# EAGLE design M700A (EAGLE 6.6.0)
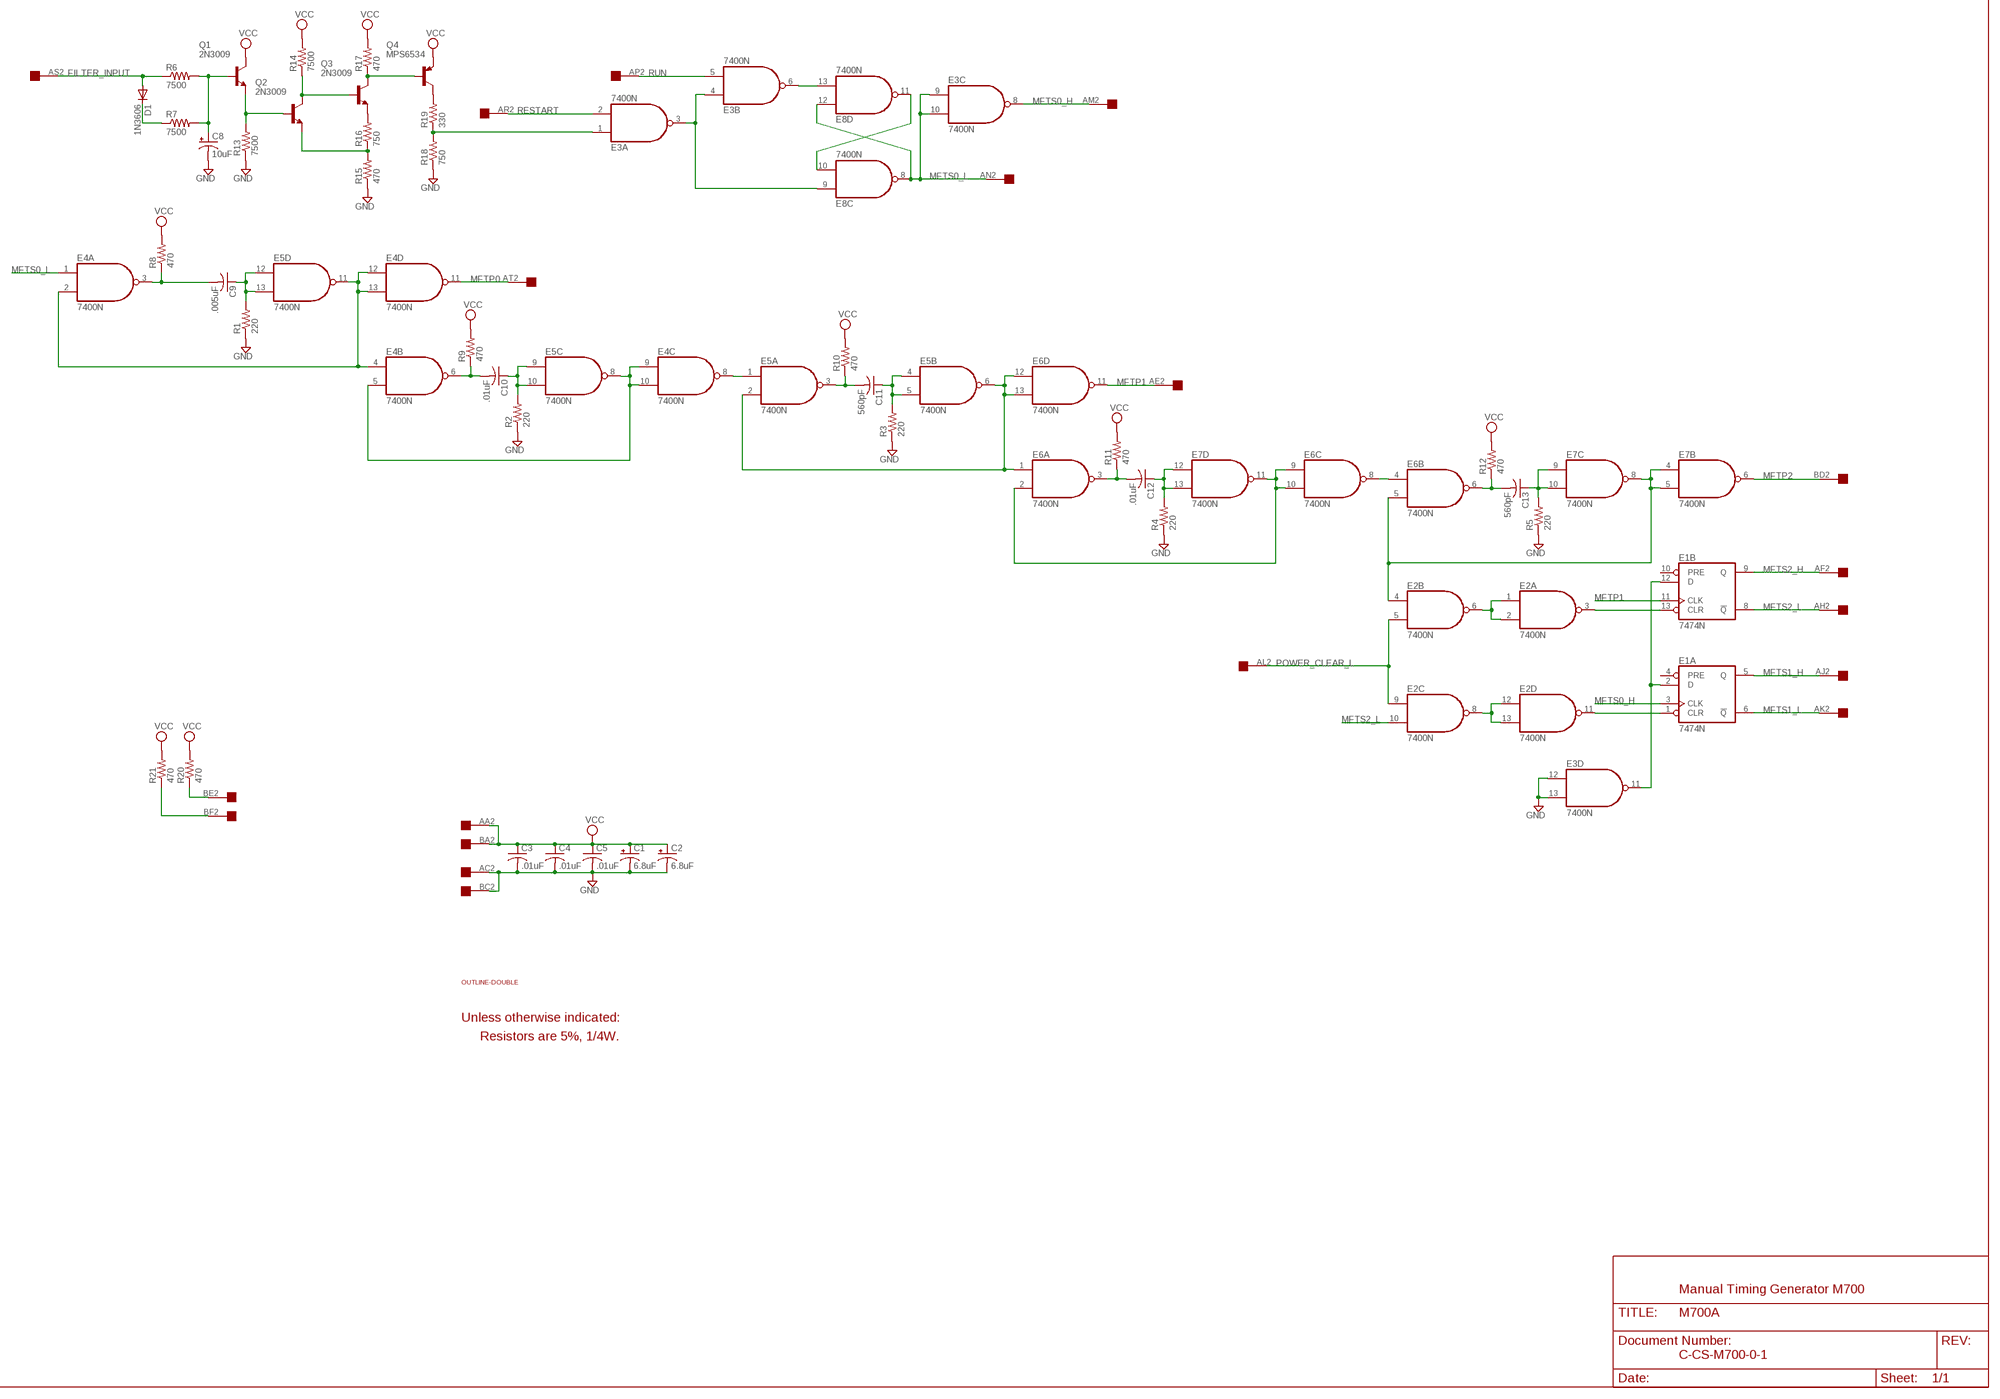
[diagram p0: schematic, sheet 1]

## Parts
C1  6.8uF  CPOL-USE15-5AXIAL  [E15-5]
C2  6.8uF  CPOL-USE15-5AXIAL  [E15-5]
C3  .01uF  C-US050-025X075  [C050-025X075]
C4  .01uF  C-US050-025X075  [C050-025X075]
C5  .01uF  C-US050-025X075  [C050-025X075]
C8  10uF  CPOL-USE15-5AXIAL  [E15-5]
C9  .005uF  C-US050-025X075  [C050-025X075]
C10  .01uF  C-US050-025X075  [C050-025X075]
C11  560pF  C-US050-025X075  [C050-025X075]
C12  .01uF  C-US050-025X075  [C050-025X075]
C13  560pF  C-US050-025X075  [C050-025X075]
D1  1N3606  1N4148DO35-10  [DO35-10]
E1  7474N  74S74N  [DIL14]
E2  7400N  [DIL14]
E3  7400N  [DIL14]
E4  7400N  [DIL14]
E5  7400N  [DIL14]
E6  7400N  [DIL14]
E7  7400N  [DIL14]
E8  7400N  [DIL14]
Q1  2N3009  2N2102  [TO5]
Q2  2N3009  2N2102  [TO5]
Q3  2N3009  2N2102  [TO5]
Q4  MPS6534  2N2905  [TO5]
R1  220  R-US_0207/10  [0207/10]
R2  220  R-US_0207/10  [0207/10]
R3  220  R-US_0207/10  [0207/10]
R4  220  R-US_0207/10  [0207/10]
R5  220  R-US_0207/10  [0207/10]
R6  7500  R-US_0207/10  [0207/10]
R7  7500  R-US_0207/10  [0207/10]
R8  470  R-US_0207/10  [0207/10]
R9  470  R-US_0207/10  [0207/10]
R10  470  R-US_0207/10  [0207/10]
R11  470  R-US_0207/10  [0207/10]
R12  470  R-US_0207/10  [0207/10]
R13  7500  R-US_0207/10  [0207/10]
R14  7500  R-US_0207/10  [0207/10]
R15  470  R-US_0207/10  [0207/10]
R16  750  R-US_0207/10  [0207/10]
R17  470  R-US_0207/10  [0207/10]
R18  750  R-US_0207/10  [0207/10]
R19  330  R-US_0207/10  [0207/10]
R20  470  R-US_0207/10  [0207/10]
R21  470  R-US_0207/10  [0207/10]
U$1  DOUBLE  [EDGE-CON4]
U$2  OUTLINE-DOUBLE  [DOUBLE]

## Nets
FILTER_INPUT: D1.A R6.1 U$1.AS2
GND [Supply]: C1.- C2.- C3.2 C4.2 C5.2 C8.- E3.12(D:I0) E3.13(D:I1) R1.1 R2.1 R3.1 R4.1 R5.1 R13.1 R15.1 R18.1 U$1.AC2 U$1.BC2
MFTP0: E4.11(D:O) U$1.AT2
MFTP1: E1.11(B:CLK) E6.11(D:O) U$1.AE2
MFTP2: E7.6(B:O) U$1.BD2
MFTS0_H: E1.3(A:CLK) E3.8(C:O) U$1.AM2
MFTS0_L: E3.9(C:I0) E3.10(C:I1) E4.1(A:I0) E8.8(C:O) E8.12(D:I0) U$1.AN2
MFTS1_H: E1.5(A:Q) U$1.AJ2
MFTS1_L: E1.6(A:!Q) U$1.AK2
MFTS2_H: E1.9(B:Q) U$1.AF2
MFTS2_L: E1.8(B:!Q) E2.10(C:I1) U$1.AH2
N$1: E1.13(B:CLR) E2.3(A:O)
N$2: E2.4(B:I0) E6.5(B:I1) E7.4(B:I0) E7.5(B:I1) E7.8(C:O)
N$3: C13.1 E7.9(C:I0) E7.10(C:I1) R5.2
N$4: C13.2 E6.6(B:O) R12.1
N$5: E2.1(A:I0) E2.2(A:I1) E2.6(B:O)
N$6: C8.+ Q1.2(B) R6.2 R7.2
N$7: E1.2(A:D) E1.12(B:D) E3.11(D:O)
N$8: D1.C R7.1
N$9: Q2.3(C) Q3.2(B) R14.1
N$10: Q1.1(E) Q2.2(B) R13.2
N$11: R21.1 U$1.BF2
N$12: R20.1 U$1.BE2
N$13: Q3.3(C) Q4.2(B) R17.1
N$14: Q3.1(E) R16.2
N$15: Q2.1(E) R15.2 R16.1
N$16: Q4.3(C) R19.2
N$17: E3.1(A:I0) R18.2 R19.1
N$18: E3.3(A:O) E3.4(B:I0) E8.9(C:I0)
N$19: E8.10(C:I1) E8.11(D:O)
N$20: C9.1 E5.12(D:I0) E5.13(D:I1) R1.2
N$21: E3.6(B:O) E8.13(D:I1)
N$22: C9.2 E4.3(A:O) R8.1
N$24: E4.2(A:I1) E4.4(B:I0) E4.12(D:I0) E4.13(D:I1) E5.11(D:O)
N$25: C10.2 E4.6(B:O) R9.1
N$26: C10.1 E5.9(C:I0) E5.10(C:I1) R2.2
N$27: E4.5(B:I1) E4.9(C:I0) E4.10(C:I1) E5.8(C:O)
N$28: C11.2 E5.3(A:O) R10.1
N$29: E4.8(C:O) E5.1(A:I0)
N$30: C11.1 E5.4(B:I0) E5.5(B:I1) R3.2
N$31: E5.2(A:I1) E5.6(B:O) E6.1(A:I0) E6.12(D:I0) E6.13(D:I1)
N$32: C12.2 E6.3(A:O) R11.1
N$33: C12.1 E7.12(D:I0) E7.13(D:I1) R4.2
N$34: E6.2(A:I1) E6.9(C:I0) E6.10(C:I1) E7.11(D:O)
N$35: E2.8(C:O) E2.12(D:I0) E2.13(D:I1)
N$36: E6.4(B:I0) E6.8(C:O)
N$38: E1.1(A:CLR) E2.11(D:O)
POWER_CLEAR_L: E2.5(B:I1) E2.9(C:I0) U$1.AL2
RESTART: E3.2(A:I1) U$1.AR2
RUN: E3.5(B:I1) U$1.AP2
VCC [Supply]: C1.+ C2.+ C3.1 C4.1 C5.1 Q1.3(C) Q4.1(E) R8.2 R9.2 R10.2 R11.2 R12.2 R14.2 R17.2 R20.2 R21.2 U$1.AA2 U$1.BA2
Unconnected: E1.4(A:PRE) E1.10(B:PRE) E7.1(A:I0) E7.2(A:I1) E7.3(A:O) E8.1(A:I0) E8.2(A:I1) E8.3(A:O) E8.4(B:I0) E8.5(B:I1) E8.6(B:O) U$1.AA1 U$1.AB1 U$1.AB2 U$1.AC1 U$1.AD1 U$1.AD2 U$1.AE1 U$1.AF1 U$1.AH1 U$1.AJ1 U$1.AK1 U$1.AL1 U$1.AM1 U$1.AN1 U$1.AP1 U$1.AR1 U$1.AS1 U$1.AT1 U$1.AU1 U$1.AU2 U$1.AV1 U$1.AV2 U$1.BA1 U$1.BB1 U$1.BB2 U$1.BC1 U$1.BD1 U$1.BE1 U$1.BF1 U$1.BH1 U$1.BH2 U$1.BJ1 U$1.BJ2 U$1.BK1 U$1.BK2 U$1.BL1 U$1.BL2 U$1.BM1 U$1.BM2 U$1.BN1 U$1.BN2 U$1.BP1 U$1.BP2 U$1.BR1 U$1.BR2 U$1.BS1 U$1.BS2 U$1.BT1 U$1.BT2 U$1.BU1 U$1.BU2 U$1.BV1 U$1.BV2

## Notes on the sheet
- Unless otherwise indicated:
- Resistors are 5%, 1/4W.
- Manual Timing Generator M700
- C-CS-M700-0-1

## Power pins joined to a net without a drawn wire
GND: E1.7(P:GND) E2.7(P:GND) E3.7(P:GND) E4.7(P:GND) E5.7(P:GND) E6.7(P:GND) E7.7(P:GND) E8.7(P:GND)
VCC: E1.14(P:VCC) E2.14(P:VCC) E3.14(P:VCC) E4.14(P:VCC) E5.14(P:VCC) E6.14(P:VCC) E7.14(P:VCC) E8.14(P:VCC)

## Library data of the parts
C1 C2 C8 = rcl:CPOL-US: POLARIZED CAPACITOR, American symbol
C3-C5 C9-C13 = rcl:C-US: CAPACITOR, American symbol
D1 = diode:1N4148: DIODE high speed (Philips)
E1 = 74xx-us:74*74: Dual D type positive edge triggered FLIP FLOP, preset and clear
E2-E8 = 74xx-us:74*00: Quad 2-input NAND gate
Q1-Q3 = transistor-npn:2N2102: NPN Transistor
Q4 = transistor-pnp:2N2905: PNP Transistor
R1-R21 = rcl:R-US_: RESISTOR, American symbol
U$1 = dec-con:DOUBLE: Double-Height DEC board
U$2 = dec-con:OUTLINE-*: Board outlines for DEC boards.

## Net classes
1 Supply: width 0.813 mm

## Board
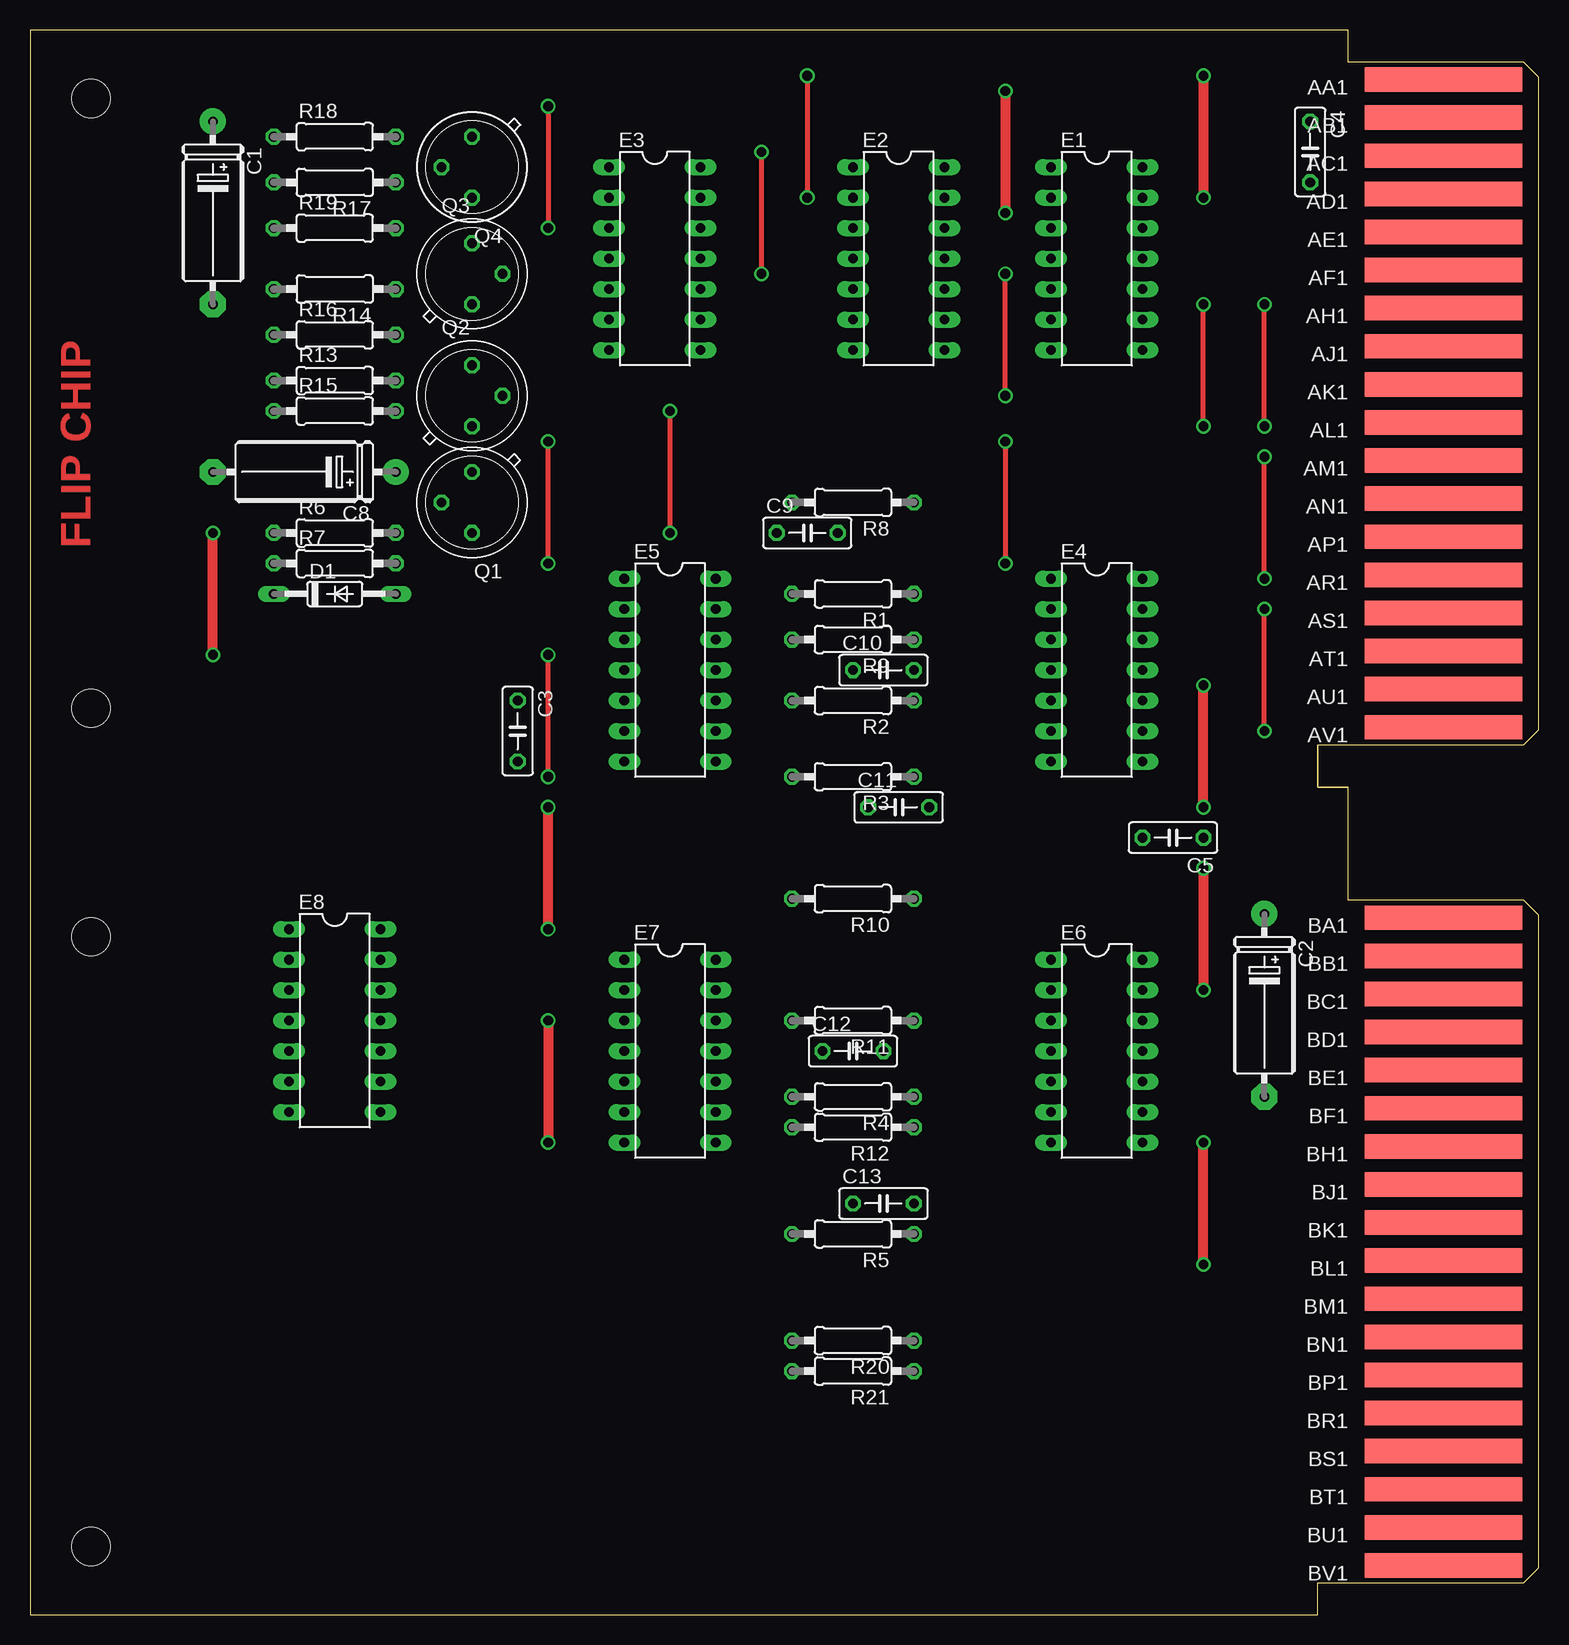
[diagram p1: board, top side]
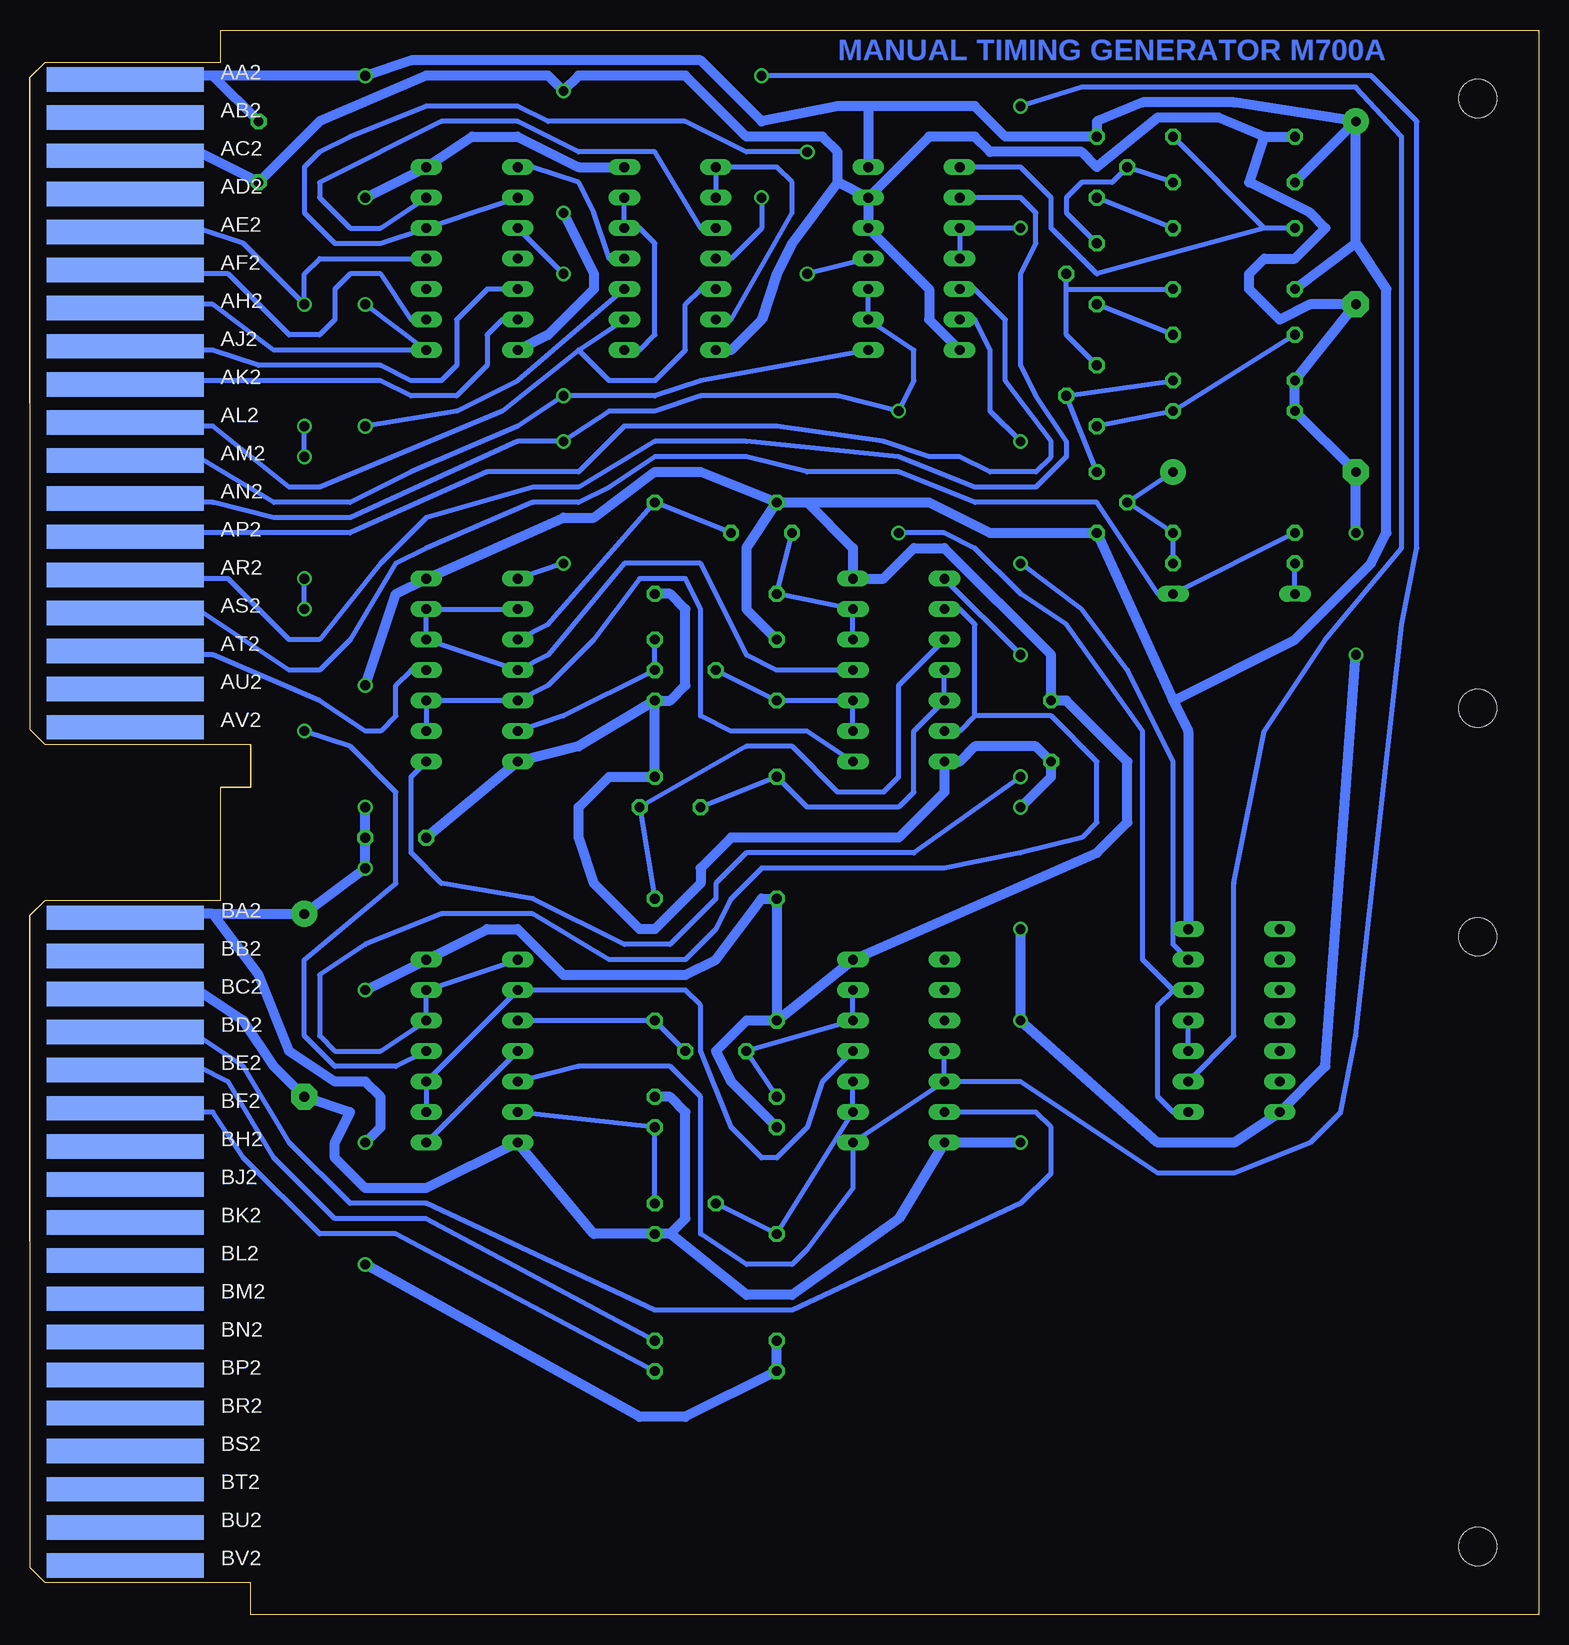
[diagram p2: board, bottom side, seen from below]

Size 125.73 x 132.08 mm. Coordinates in mm from the lower left corner, seen from the top.
Copper layers (1+16): Top 0.035mm / dielectric 1.5mm / Bottom 0.035mm
Design rules "16mils": minimum track width 16mil, minimum drill 32mil, track to track 15mil, track to pad 10mil, pad to pad 10mil, via to via 10mil, smd to smd 10mil, copper to edge 13mil, drill to drill 10mil, minimum pad ring 10mil, minimum via ring 8mil, stop-mask expansion 0mil, vias tented up to drill 0mil, thermal gap 10mil

### Footprints (pad centres in the part's own frame; a part is rotated, then mirrored left to right if it is on the bottom)
E15-5 = drill 0.813 pad 2.159: + -7.62,0 | drill 0.813 pad 2.159 octagon: - 7.62,0
C050-025X075 = drill 0.813 octagon: 1 -2.54,0; 2 2.54,0
DO35-10 = drill 0.813 long: A 5.08,0; C -5.08,0
DIL14 = drill 0.813 long: 1 -7.62,-3.81; 2 -5.08,-3.81; 3 -2.54,-3.81; 4 0,-3.81; 5 2.54,-3.81; 6 5.08,-3.81; 7 7.62,-3.81; 8 7.62,3.81; 9 5.08,3.81; 10 2.54,3.81; 11 0,3.81; 12 -2.54,3.81; 13 -5.08,3.81; 14 -7.62,3.81
TO5 = drill 0.813 octagon: 1 0,-2.54; 2 2.54,0; 3 0,2.54
0207/10 = drill 0.813 octagon: 1 -5.08,0; 2 5.08,0
EDGE-CON4 = smd 13.106 x 2.032: AA1 7.938,4.128; AB1 7.938,7.303; AC1 7.938,10.477; AD1 7.938,13.652; AE1 7.938,16.828; AF1 7.938,20.003; AH1 7.938,23.177; AJ1 7.938,26.352; AK1 7.938,29.527; AL1 7.938,32.703; AM1 7.938,35.877; AN1 7.938,39.053; AP1 7.938,42.227; AR1 7.938,45.403; AS1 7.938,48.578; AT1 7.938,51.752; AU1 7.938,54.928; AV1 7.938,58.102; BA1 7.938,73.978; BB1 7.938,77.153; BC1 7.938,80.328; BD1 7.938,83.502; BE1 7.938,86.677; BF1 7.938,89.853; BH1 7.938,93.028; BJ1 7.938,96.203; BK1 7.938,99.377; BL1 7.938,102.552; BM1 7.938,105.728; BN1 7.938,108.903; BP1 7.938,112.078; BR1 7.938,115.252; BS1 7.938,118.427; BT1 7.938,121.603; BU1 7.938,124.778; BV1 7.938,127.953 | smd 13.106 x 2.032 bottom: AA2 7.938,4.128; AB2 7.938,7.303; AC2 7.938,10.477; AD2 7.938,13.652; AE2 7.938,16.828; AF2 7.938,20.003; AH2 7.938,23.177; AJ2 7.938,26.352; AK2 7.938,29.527; AL2 7.938,32.703; AM2 7.938,35.877; AN2 7.938,39.053; AP2 7.938,42.227; AR2 7.938,45.403; AS2 7.938,48.578; AT2 7.938,51.752; AU2 7.938,54.928; AV2 7.938,58.102; BA2 7.938,73.978; BB2 7.938,77.153; BC2 7.938,80.328; BD2 7.938,83.502; BE2 7.938,86.677; BF2 7.938,89.853; BH2 7.938,93.028; BJ2 7.938,96.203; BK2 7.938,99.377; BL2 7.938,102.552; BM2 7.938,105.728; BN2 7.938,108.903; BP2 7.938,112.078; BR2 7.938,115.252; BS2 7.938,118.427; BT2 7.938,121.603; BU2 7.938,124.778; BV2 7.938,127.953
DOUBLE = hole 3.175: 120.65,56.515; 120.65,5.715; 120.65,75.565; 120.65,126.365

### Placement (x,y rotation side)
C1  15.24,116.84 270 top
C2  102.87,50.8 270 top
C3  40.64,73.66 270 top
C4  106.68,121.92 270 top
C5  95.25,64.77 180 top
C8  22.86,95.25 180 top
C9  64.77,90.17 0 top
C10  71.12,78.74 0 top
C11  72.39,67.31 0 top
C12  68.58,46.99 0 top
C13  71.12,34.29 0 top
D1  25.4,85.09 0 top
E1  88.9,113.03 270 top
E2  72.39,113.03 270 top
E3  52.07,113.03 270 top
E4  88.9,78.74 270 top
E5  53.34,78.74 270 top
E6  88.9,46.99 270 top
E7  53.34,46.99 270 top
E8  25.4,49.53 270 top
Q1  36.83,92.71 180 top
Q2  36.83,101.6 0 top
Q3  36.83,111.76 0 top
Q4  36.83,120.65 180 top
R1  68.58,85.09 180 top
R2  68.58,76.2 180 top
R3  68.58,69.85 180 top
R4  68.58,43.18 180 top
R5  68.58,31.75 180 top
R6  25.4,90.17 0 top
R7  25.4,87.63 0 top
R8  68.58,92.71 180 top
R9  68.58,81.28 180 top
R10  68.58,59.69 180 top
R11  68.58,49.53 180 top
R12  68.58,40.64 180 top
R13  25.4,102.87 0 top
R14  25.4,110.49 180 top
R15  25.4,100.33 0 top
R16  25.4,106.68 0 top
R17  25.4,119.38 180 top
R18  25.4,123.19 0 top
R19  25.4,115.57 0 top
R20  68.58,22.86 180 top
R21  68.58,20.32 180 top
U$1  125.73,132.08 180 top
U$2  125.73,132.08 180 top
U$4  [FLIPCHIP]  0,69.85 0 top

### Tracks (layer width: path | path; a pad name or v marks a point on that pad's centre or on a via)
FILTER_INPUT
  Bottom 0.406: R6.1 D1.A 31.75,85.09 36.83,92.71 46.99,92.71 53.34,95.25 60.96,95.25 66.04,96.52 73.66,96.52 77.47,93.98 80.01,92.71 83.82,92.71 92.71,88.9 95.25,87.63 99.06,81.28 101.6,78.74 104.14,78.74 111.76,83.82 116.84,83.82 U$1.AS2
GND  (via drill 0.81)
  Top 0.813: v15.24,80.01 v15.24,90.17 | v43.18,57.15 v43.18,67.31 | v43.18,49.53 v43.18,39.37 | v81.28,127 v81.28,116.84
  Bottom 0.813: v15.24,90.17 C8.- R15.1 R13.1 C1.- 19.05,109.22 21.59,107.95 24.13,110.49 24.13,111.76 22.86,113.03 20.32,113.03 17.78,115.57 19.05,116.84 24.13,119.38 22.86,123.19 | v15.24,80.01 17.78,45.72 E8.7 25.4,39.37 31.75,39.37 v43.18,49.53 v43.18,57.15 | v43.18,39.37 E7.7 53.34,33.02 62.23,26.67 66.04,26.67 72.39,31.75 | v43.18,67.31 40.64,69.85 C3.2 41.91,72.39 46.99,72.39 48.26,71.12 E5.7 49.53,68.58 53.34,64.77 67.31,64.77 69.85,62.23 69.85,60.96 73.66,57.15 74.93,57.15 78.74,60.96 80.01,64.77 80.01,67.31 77.47,69.85 R3.1 R2.1 | 22.86,123.19 R18.1 | E3.7 50.8,107.95 50.8,110.49 E3.12 E3.13 | E3.13 50.8,123.19 46.99,123.19 45.72,121.92 38.1,121.92 36.83,120.65 31.75,124.78 26.67,124.78 22.86,123.19 | U$1.AC2 116.84,121.92 111.76,121.92 C4.2 101.6,124.46 92.71,128.27 82.55,128.27 v81.28,127 80.01,128.27 71.12,128.27 66.04,123.19 59.69,123.19 58.42,121.92 58.42,119.38 | E3.13 58.42,119.38 | E2.7 67.31,105.41 64.77,107.95 63.5,111.76 62.23,114.3 58.42,119.38 | E1.7 82.55,106.68 78.74,110.49 78.74,111.76 v81.28,116.84 | U$1.BC2 116.84,52.07 111.76,52.07 107.95,49.53 105.41,45.72 C2.- 99.06,41.91 100.33,39.37 100.33,38.1 97.79,35.56 92.71,35.56 E6.7 78.74,31.75 R5.1 | R2.1 80.01,72.39 E4.7 C5.2 | 72.39,31.75 R5.1 | R1.1 72.39,85.09 71.12,83.82 71.12,77.47 72.39,76.2 R2.1 | R4.1 72.39,43.18 71.12,41.91 71.12,33.02 72.39,31.75 | 72.39,31.75 R5.1
MFTP0
  Bottom 0.406: U$1.AT2 116.84,80.01 110.49,80.01 101.6,76.2 97.79,73.66 96.52,73.66 95.25,74.93 95.25,77.47 93.98,78.74 E4.11
MFTP1  (via drill 0.81)
  Top 0.406: v102.87,99.06 v102.87,109.22 | v102.87,86.36 v102.87,96.52 | v102.87,73.66 v102.87,83.82
  Bottom 0.406: U$1.AE2 116.84,115.57 111.76,115.57 107.95,114.3 v102.87,109.22 102.87,111.76 101.6,113.03 E1.11 | v102.87,96.52 v102.87,99.06 | v102.87,83.82 v102.87,86.36 | v102.87,73.66 99.06,72.39 95.25,68.58 95.25,60.96 102.87,54.61 102.87,48.26 100.33,45.72 95.25,45.72 E6.11
MFTP2
  Bottom 0.406: U$1.BD2 116.84,48.26 111.76,48.26 107.95,45.72 104.14,39.37 99.06,34.29 92.71,34.29 73.66,25.4 62.23,25.4 43.18,34.29 40.64,36.83 40.64,40.64 41.91,41.91 E7.6
MFTS0_H  (via drill 0.81)
  Top 0.406: v81.28,101.6 v81.28,111.76
  Bottom 0.406: v81.28,111.76 E1.3 | U$1.AM2 116.84,96.52 111.76,96.52 105.41,92.71 99.06,92.71 93.98,95.25 85.09,99.06 v81.28,101.6 73.66,101.6 69.85,102.87 E3.8
MFTS0_L  (via drill 0.81)
  Top 0.406: v53.34,90.17 v53.34,100.33 | v81.28,97.79 v81.28,87.63
  Bottom 0.406: 30.48,52.07 E8.12 | 30.48,52.07 31.75,50.8 31.75,43.18 30.48,41.91 E8.8 | 30.48,52.07 33.02,54.61 33.02,73.66 39.37,82.55 43.18,85.09 46.99,88.9 49.53,90.17 v53.34,90.17 | E3.10 E3.9 52.07,105.41 52.07,102.87 v53.34,100.33 58.42,101.6 69.85,101.6 73.66,100.33 77.47,100.33 v81.28,97.79 85.09,97.79 99.06,91.44 105.41,91.44 110.49,92.71 116.84,92.71 U$1.AN2 | v81.28,87.63 E4.1
MFTS1_H
  Bottom 0.406: U$1.AJ2 115.57,105.41 110.49,105.41 106.68,104.14 96.52,104.14 93.98,102.87 91.44,102.87 90.17,104.14 90.17,107.95 87.63,110.49 E1.5
MFTS1_L
  Bottom 0.406: E1.6 86.36,107.95 87.63,106.68 87.63,104.14 90.17,101.6 93.98,101.6 96.52,102.87 116.84,102.87 U$1.AK2
MFTS2_H
  Bottom 0.406: U$1.AF2 116.84,111.76 109.22,111.76 104.14,106.68 101.6,106.68 100.33,107.95 100.33,110.49 99.06,111.76 96.52,111.76 93.98,107.95 E1.9
MFTS2_L  (via drill 0.81)
  Top 0.406: v97.79,99.06 v97.79,109.22
  Bottom 0.406: E2.10 85.09,102.87 90.17,100.33 v97.79,99.06 | v97.79,109.22 E1.8 105.41,105.41 110.49,109.22 116.84,109.22 U$1.AH2
N$1
  Bottom 0.406: E1.13 96.52,115.57 99.06,115.57 101.6,118.11 101.6,119.38 91.44,124.46 85.09,124.46 80.01,121.92 73.66,121.92 69.85,115.57 E2.3
N$2  (via drill 0.81)
  Top 0.406: v64.77,128.27 v64.77,118.11
  Bottom 0.406: E7.5 E7.4 | E7.5 E7.8 57.15,35.56 60.96,30.48 62.23,29.21 66.04,29.21 69.85,31.75 69.85,43.18 72.39,45.72 80.01,45.72 E6.5 | E7.5 43.18,44.45 31.75,36.83 25.4,36.83 19.05,39.37 16.51,41.91 15.24,48.26 11.43,82.55 10.16,88.9 10.16,124.46 13.97,128.27 v64.77,128.27 | v64.77,118.11 64.77,115.57 67.31,113.03 E2.4
N$3
  Bottom 0.406: C13.1 R5.2 E7.9 E7.10
N$4
  Bottom 0.406: E6.6 R12.1 C13.2
N$5
  Bottom 0.406: E2.2 E2.1 63.5,120.65 62.23,119.38 62.23,116.84 67.31,107.95 E2.6
N$6
  Bottom 0.406: R7.2 R6.2 Q1.2 C8.+
N$7  (via drill 0.81)
  Top 0.406: v60.96,111.76 v60.96,121.92
  Bottom 0.406: E3.11 v60.96,111.76 | v60.96,121.92 66.04,121.92 71.12,124.46 82.55,124.46 85.09,125.73 92.71,125.73 99.06,123.19 101.6,121.92 102.87,120.65 102.87,116.84 100.33,114.3 96.52,114.3 E1.12 88.9,116.84 E1.2
N$8
  Bottom 0.406: D1.C R7.1
N$9
  Bottom 0.406: 39.37,110.49 39.37,106.68 Q2.3 | 39.37,110.49 Q3.2 | 39.37,110.49 R14.1
N$10
  Bottom 0.406: Q1.1 Q2.2 R13.2
N$11
  Bottom 0.406: R21.1 95.25,31.75 101.6,31.75 107.95,38.1 110.49,41.91 116.84,41.91 U$1.BF2
N$12
  Bottom 0.406: R20.1 92.71,33.02 100.33,33.02 105.41,38.1 109.22,44.45 111.76,45.72 116.84,45.72 U$1.BE2
N$13
  Bottom 0.406: R17.1 Q4.2 35.56,119.38 38.1,119.38 39.37,118.11 39.37,116.84 Q3.3
N$14
  Bottom 0.406: R16.2 Q3.1
N$15
  Bottom 0.406: Q2.1 R15.2 R16.1
N$16
  Bottom 0.406: R19.2 Q4.3
N$17
  Bottom 0.406: E3.1 43.18,120.65 40.64,118.11 40.64,115.57 36.83,111.76 22.86,115.57 | R19.1 22.86,115.57 | 22.86,115.57 R18.2
N$18  (via drill 0.81)
  Top 0.406: v43.18,125.73 v43.18,115.57
  Bottom 0.406: E8.9 25.4,48.26 25.4,60.96 22.86,73.66 17.78,81.28 11.43,88.9 11.43,123.19 15.24,127.32 38.1,127.32 v43.18,125.73 | v43.18,115.57 E3.3 E3.4
N$19
  Bottom 0.406: E8.10 E8.11
N$20
  Bottom 0.406: E5.12 E5.13 R1.2 C9.1
N$21  (via drill 0.81)
  Top 0.406: v43.18,87.63 v43.18,97.79
  Bottom 0.406: E3.6 46.99,107.95 45.72,105.41 45.72,100.33 v43.18,97.79 | v43.18,87.63 38.1,83.82 34.29,78.74 30.48,71.12 30.48,55.88 E8.13
N$22
  Bottom 0.406: E4.3 82.55,82.55 R8.1 C9.2
N$24
  Bottom 0.406: E4.2 E4.13 E4.12 E4.4 82.55,80.01 76.2,87.63 69.85,87.63 66.04,80.01 63.5,78.74 E5.11
N$25
  Bottom 0.406: E4.6 81.28,74.93 C10.2 R9.1
N$26
  Bottom 0.406: E5.9 E5.10 R2.2 C10.1
N$27
  Bottom 0.406: E4.9 E4.10 E4.5 82.55,77.47 78.74,81.28 74.93,86.36 71.12,86.36 69.85,83.82 69.85,74.93 67.31,73.66 60.96,73.66 E5.8
N$28
  Bottom 0.406: R10.1 C11.2 66.04,72.39 62.23,72.39 58.42,68.58 54.61,68.58 53.34,69.85 53.34,77.47 E5.3
N$29  (via drill 0.81)
  Top 0.406: v43.18,69.85 v43.18,80.01
  Bottom 0.406: E4.8 93.98,69.85 93.98,63.5 91.44,60.96 83.82,59.69 76.2,55.88 72.39,55.88 68.58,59.69 68.58,60.96 66.04,63.5 52.07,63.5 v43.18,69.85 | v43.18,80.01 E5.1
N$30
  Bottom 0.406: C11.1 R3.2 60.96,67.31 53.34,67.31 52.07,68.58 52.07,73.66 E5.5 E5.4
N$31
  Bottom 0.406: E5.6 48.26,73.66 46.99,74.93 | 46.99,74.93 46.99,82.55 48.26,83.82 E5.2 | E6.1 E6.13 E6.12 96.52,46.99 100.33,46.99 101.6,48.26 101.6,53.34 97.79,55.88 91.44,58.42 83.82,58.42 77.47,54.61 71.12,54.61 68.58,57.15 67.31,59.69 64.77,62.23 49.53,62.23 43.18,63.5 38.1,64.77 36.83,66.04 36.83,71.12 40.64,74.93 46.99,74.93
N$32
  Bottom 0.406: C12.2 R11.1 E6.3
N$33
  Bottom 0.406: E7.13 E7.12 C12.1 R4.2
N$34
  Bottom 0.406: E6.9 E6.10 E6.2 71.12,52.07 69.85,50.8 69.85,46.99 67.31,40.64 64.77,38.1 63.5,38.1 60.96,40.64 59.69,44.45 E7.11
N$35
  Bottom 0.406: E2.13 E2.12 74.93,115.57 73.66,114.3 73.66,106.68 74.93,105.41 E2.8
N$36
  Bottom 0.406: E6.8 E6.4
N$38
  Bottom 0.406: E2.11 77.47,113.03 78.74,116.84 80.01,119.38 83.82,120.65 E1.1
POWER_CLEAR_L
  Bottom 0.406: U$1.AL2 116.84,99.06 110.49,99.06 104.14,93.98 101.6,93.98 86.36,100.33 80.01,105.41 | 80.01,105.41 E2.9 | E2.5 69.85,110.49 71.12,109.22 71.12,105.41 73.66,102.87 77.47,102.87 80.01,105.41
RESTART
  Bottom 0.406: U$1.AR2 116.84,86.36 109.22,86.36 104.14,81.28 101.6,81.28 96.52,87.63 92.71,91.44 83.82,93.98 80.01,93.98 73.66,97.79 66.04,97.79 53.34,96.52 46.99,93.98 41.91,93.98 39.37,96.52 39.37,97.79 41.91,101.6 43.18,104.14 43.18,111.76 41.91,114.3 41.91,116.84 43.18,118.11 E3.2
RUN
  Bottom 0.406: E3.5 46.99,110.49 44.45,107.95 44.45,102.87 40.64,97.79 40.64,96.52 41.91,95.25 45.72,95.25 48.26,96.52 50.8,96.52 54.61,97.79 63.5,99.06 76.2,99.06 80.01,95.25 87.63,95.25 99.06,90.17 116.84,90.17 U$1.AP2
VCC  (via drill 0.81)
  Top 0.813: v97.79,128.27 v97.79,118.11 | v97.79,67.31 v97.79,77.47 | v97.79,62.23 v97.79,52.07 | v97.79,29.21 v97.79,39.37
  Bottom 0.813: C1.+ 25.4,126.05 33.02,126.05 36.83,124.46 Q4.1 44.45,123.19 46.99,125.73 55.88,125.73 | C1.+ R17.2 | 15.24,114.3 R14.2 | 15.24,114.3 C1.+ | 15.24,114.3 12.7,110.49 12.7,90.17 13.97,87.63 20.32,81.28 30.48,76.2 | 30.48,76.2 Q1.3 45.72,90.17 50.8,92.71 60.96,92.71 | E8.14 29.21,73.66 30.48,76.2 | U$1.AA2 116.84,128.27 110.49,128.27 | 110.49,128.27 v97.79,128.27 93.98,129.54 69.85,129.54 64.77,124.46 58.42,125.73 55.88,125.73 | 55.88,125.73 E3.14 | 110.49,128.27 C4.1 | E2.14 80.01,120.65 85.09,123.19 88.9,123.19 E1.14 v97.79,118.11 | v97.79,77.47 95.25,85.09 E4.14 81.28,91.44 78.74,91.44 73.66,95.25 69.85,95.25 R8.2 | v97.79,67.31 C5.1 v97.79,62.23 C2.+ 110.49,58.42 | U$1.BA2 116.84,58.42 110.49,58.42 | v97.79,52.07 E6.14 87.63,57.15 85.09,57.15 81.28,53.34 71.12,53.34 68.58,54.61 64.77,59.69 R10.2 R11.2 | R20.2 R21.2 71.12,16.51 74.93,16.51 v97.79,29.21 | v97.79,39.37 96.52,40.64 96.52,43.18 97.79,44.45 100.33,44.45 104.14,46.99 106.68,53.34 110.49,58.42 | R8.2 60.96,92.71 | 60.96,92.71 57.15,88.9 E5.14 54.61,86.36 52.07,88.9 49.53,88.9 40.64,80.01 C3.1 39.37,76.2 34.29,71.12 34.29,66.04 36.83,63.5 E7.14 R11.2 | R9.2 66.04,83.82 66.04,88.9 R8.2 | R12.2 67.31,44.45 68.58,46.99 66.04,49.53 R11.2

### Text on the board
Bottom: MANUAL TIMING GENERATOR M700A